# Altium schematic sheet HLK-7621-ALL-KIT-V2.4.SchDoc
size A1
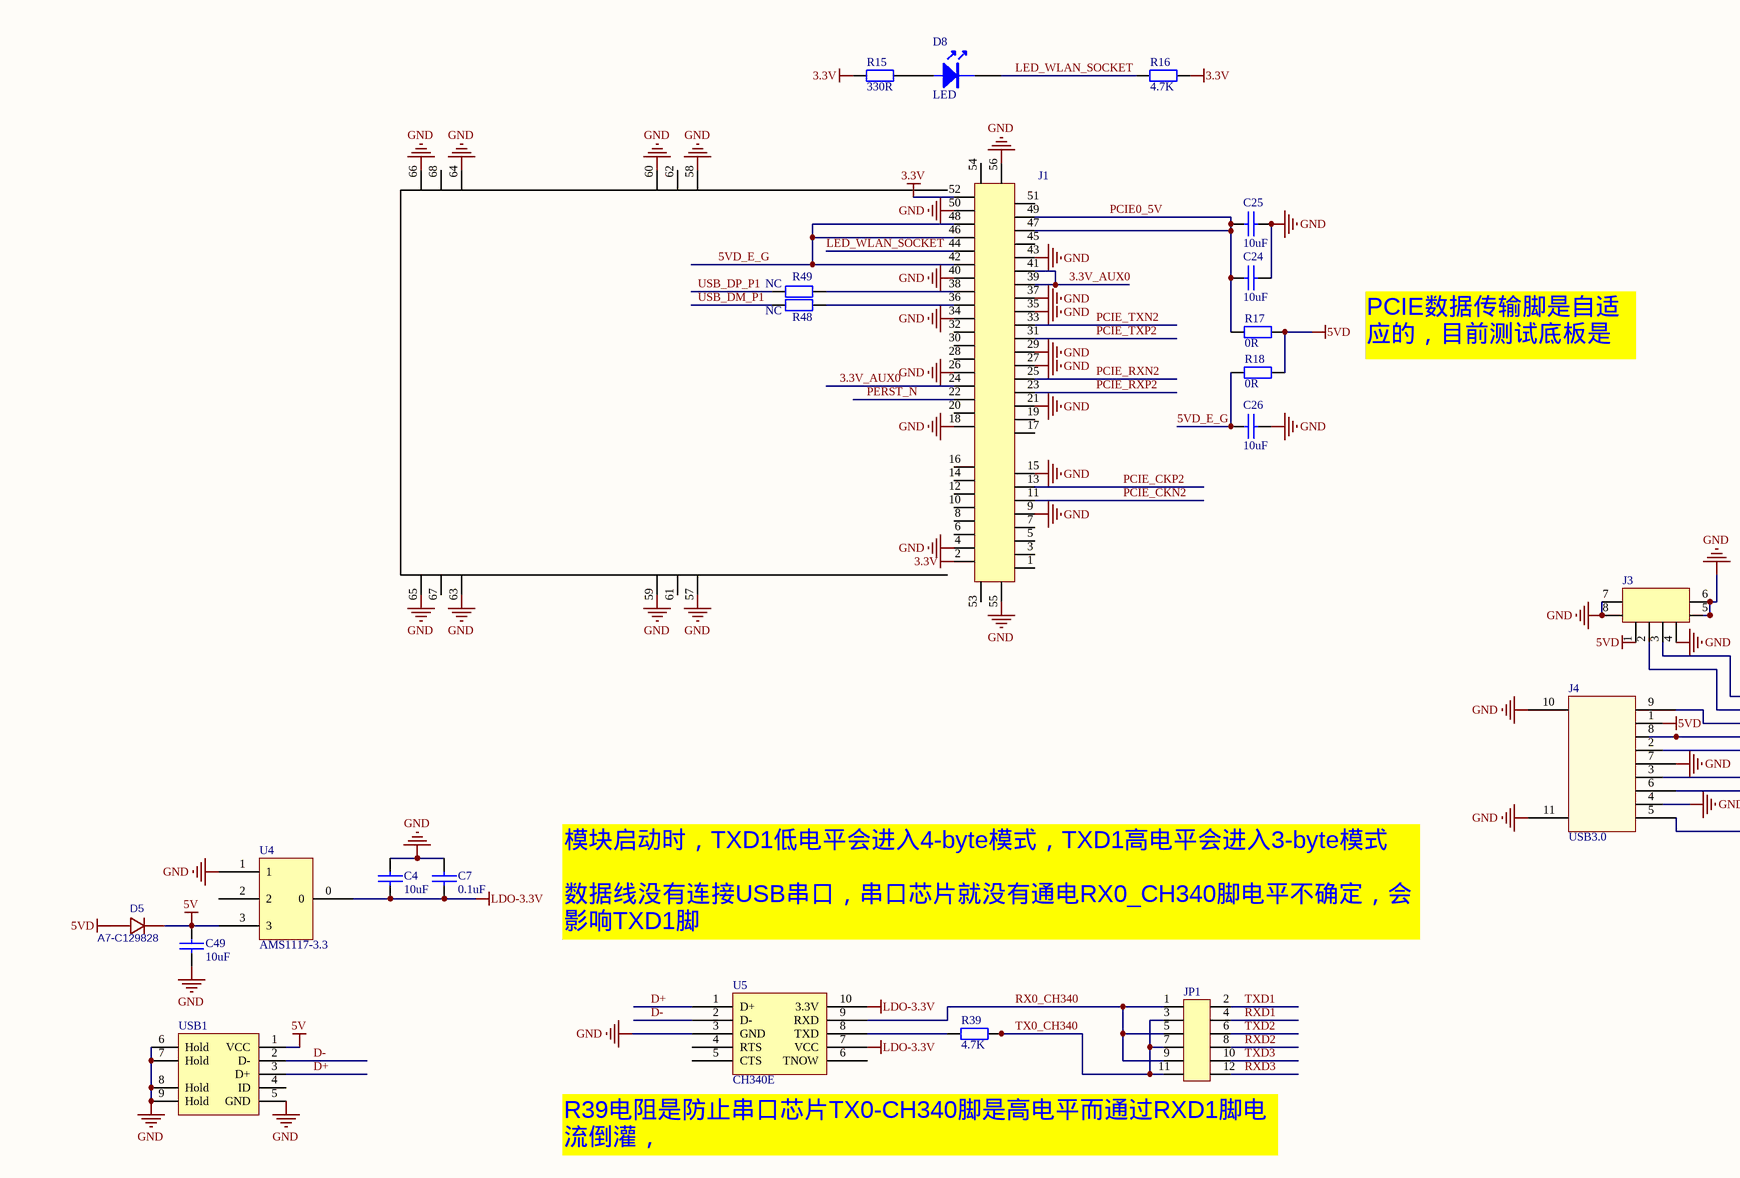
[diagram p0: HLK-7621-ALL-KIT-V2.4.SchDoc, top left]
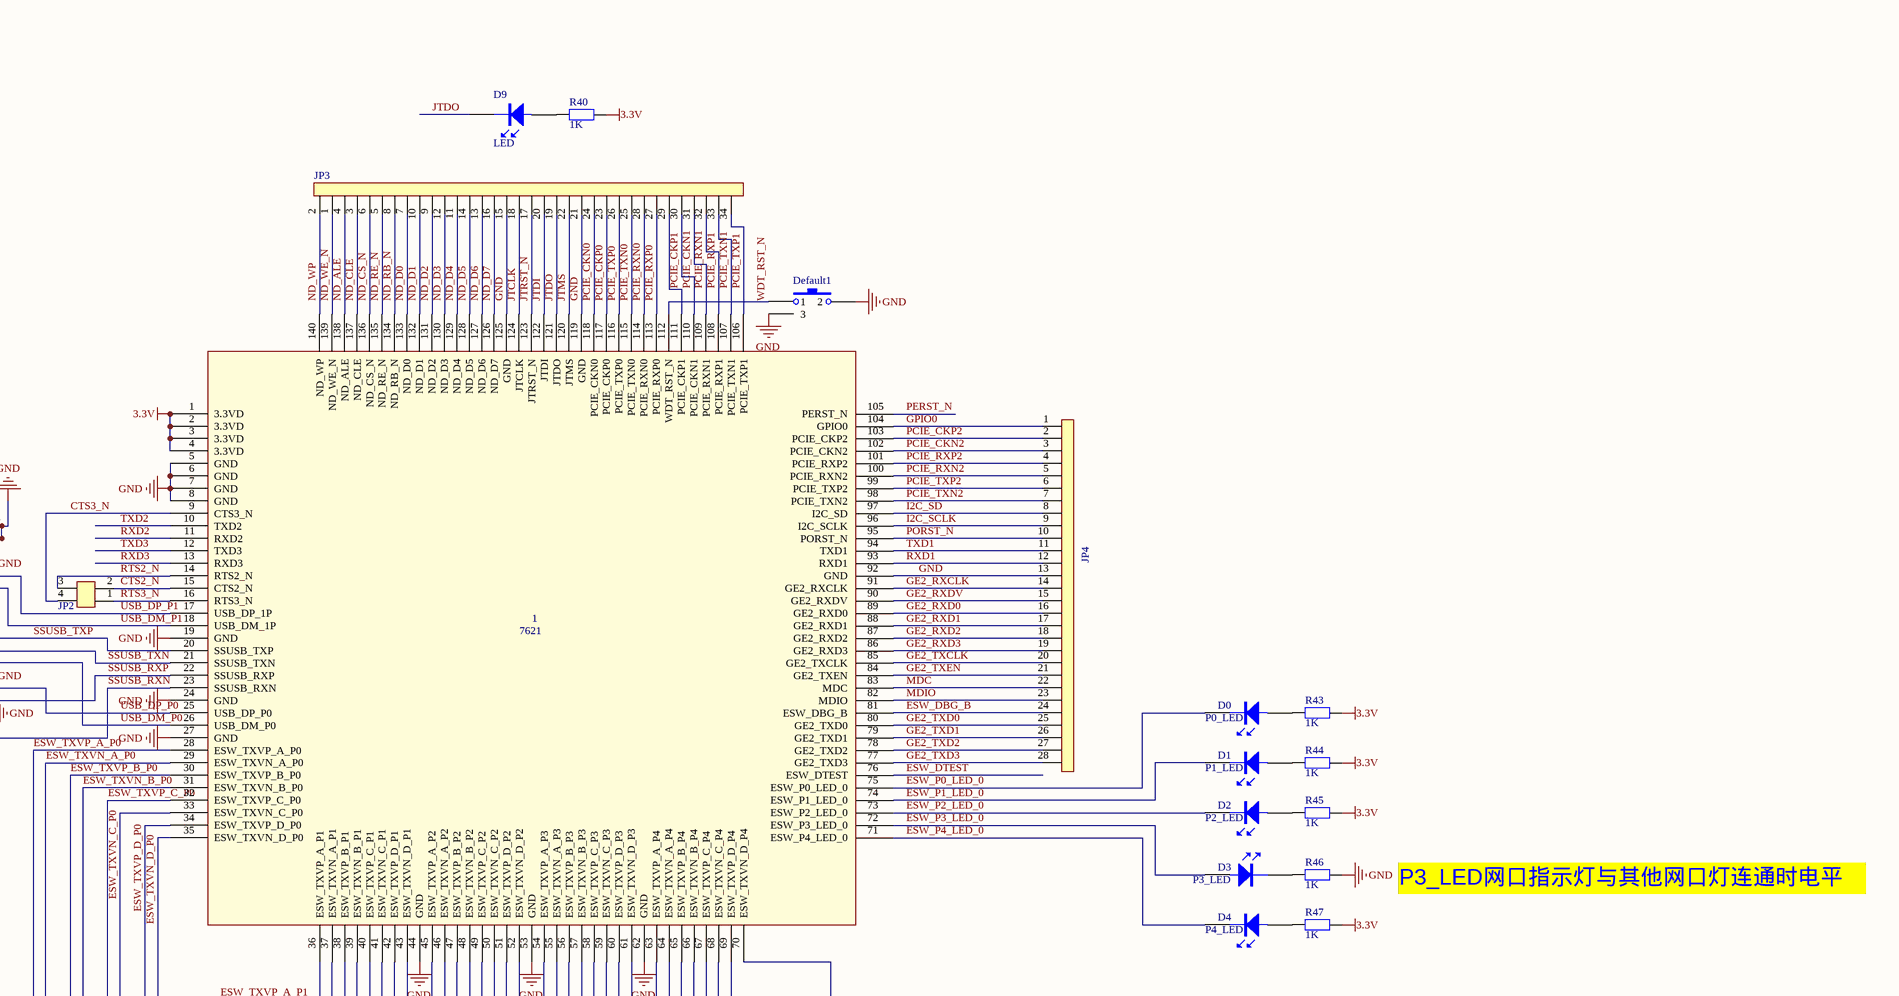
[diagram p1: HLK-7621-ALL-KIT-V2.4.SchDoc, top right]
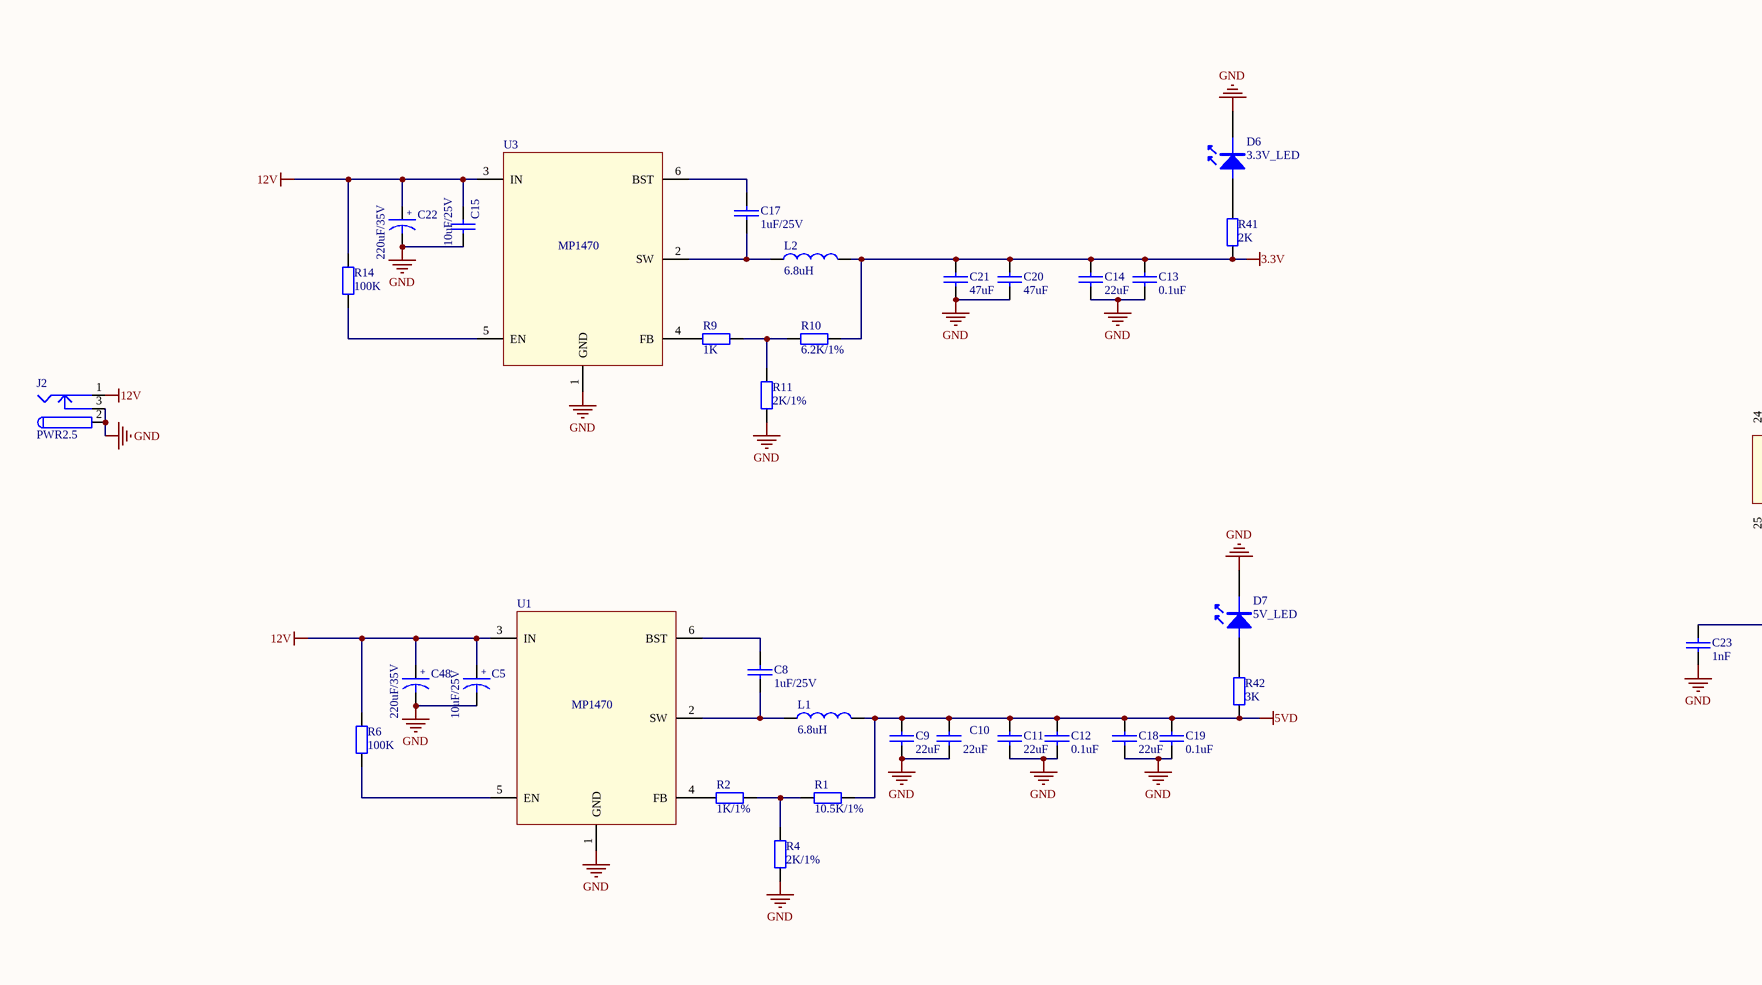
[diagram p2: HLK-7621-ALL-KIT-V2.4.SchDoc, bottom left]
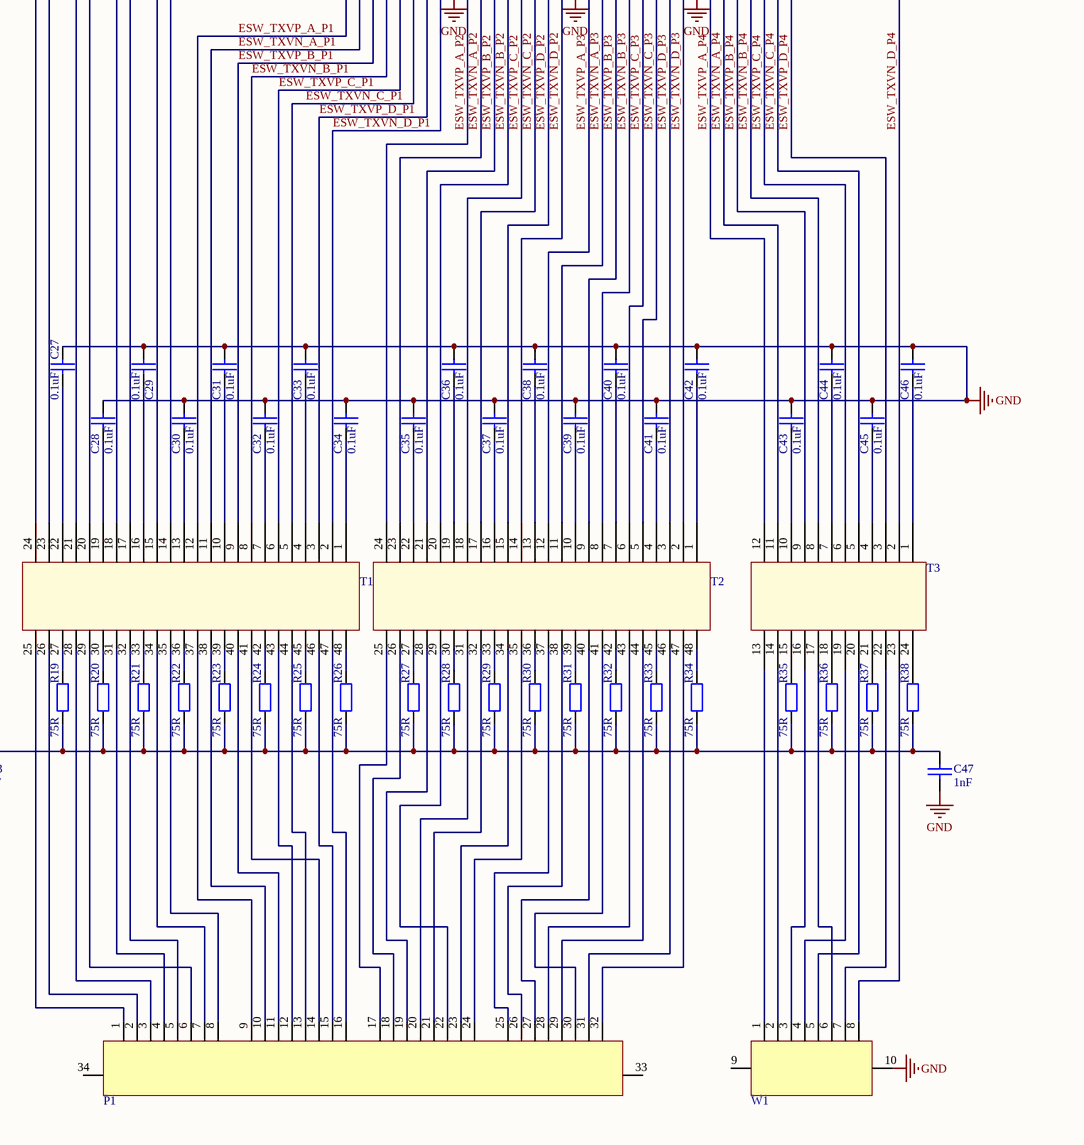
[diagram p3: HLK-7621-ALL-KIT-V2.4.SchDoc, bottom right]

## Parts
1  7621  [HLK-7621]
C4  10uF  [0603]
C5  10uF/25V  [L0805]
C7  0.1uF  [0603]
C8  1uF/25V  [0603]
C9  22uF  [0603]
C10  22uF  [0603]
C11  22uF  [0603]
C12  0.1uF  [0603]
C13  0.1uF  [0603]
C14  22uF  [0603]
C15  10uF/25V  [L0805]
C17  1uF/25V  [0603]
C18  22uF  [0603]
C19  0.1uF  [0603]
C20  47uF  [0603]
C21  47uF  [0603]
C22  220uF/35V  [CAP_SMT_8*10.5]
C23  1nF  [C1206]
C24  10uF  [C1206]
C25  10uF  [C1206]
C26  10uF  [C1206]
C27  0.1uF  [C0402]
C28  0.1uF  [C0402]
C29  0.1uF  [C0402]
C30  0.1uF  [C0402]
C31  0.1uF  [C0402]
C32  0.1uF  [C0402]
C33  0.1uF  [C0402]
C34  0.1uF  [C0402]
C35  0.1uF  [C0402]
C36  0.1uF  [C0402]
C37  0.1uF  [C0402]
C38  0.1uF  [C0402]
C39  0.1uF  [C0402]
C40  0.1uF  [C0402]
C41  0.1uF  [C0402]
C42  0.1uF  [C0402]
C43  0.1uF  [C0402]
C44  0.1uF  [C0402]
C45  0.1uF  [C0402]
C46  0.1uF  [C0402]
C47  1nF  [C1206]
C48  220uF/35V  [CAP_SMT_8*10.5]
C49  10uF  [0603]
D0  P0_LED  [0603LED]
D1  P1_LED  [0603LED]
D2  P2_LED  [0603LED]
D3  P3_LED  [0603LED]
D4  P4_LED  [0603LED]
D5  A7-C129828  [SOD-123F_L2.8-W1.8-LS3.7-RD]
D6  3.3V_LED  [0603LED]
D7  5V_LED  [0603LED]
D8  LED  [0603LED]
D9  LED  [0603LED]
Default1  SW-PB  [K5]  (value not drawn)
J1  (no value)  [CONSG/54/MINICARD/AS0B22-S68-7F/HALF/FUL]
J2  PWR2.5
J3  (no value)
J4  USB3.0
JP1  (no value)  [HDR2X6]
JP2  (no value)  [HDR2X2]
JP3  (no value)  [HDR2X17]
JP4  2  [HDR2X17]  (value not drawn)
L1  6.8uH  [4.7uH SMD,5.8x5.2x4.5mm]
L2  6.8uH  [4.7uH SMD,5.8x5.2x4.5mm]
P1  Component_2  [PHJ8X4_N]  (value not drawn)
R1  10.5K/1%  [0603]
R2  1K/1%  [0603]
R4  2K/1%  [0603]
R6  100K  [0603]
R9  1K  [0603]
R10  6.2K/1%  [0603]
R11  2K/1%  [0603]
R14  100K  [0603]
R15  330R  [0603]
R16  4.7K  [0603]
R17  0R  [L0805]
R18  0R  [R1206]
R19  75R  [R0402]
R20  75R  [R0402]
R21  75R  [R0402]
R22  75R  [R0402]
R23  75R  [R0402]
R24  75R  [R0402]
R25  75R  [R0402]
R26  75R  [R0402]
R27  75R  [R0402]
R28  75R  [R0402]
R29  75R  [R0402]
R30  75R  [R0402]
R31  75R  [R0402]
R32  75R  [R0402]
R33  75R  [R0402]
R34  75R  [R0402]
R35  75R  [R0402]
R36  75R  [R0402]
R37  75R  [R0402]
R38  75R  [R0402]
R39  4.7K  [0603]
R40  1K  [0603]
R41  2K  [0603]
R42  3K  [0603]
R43  1K  [0603]
R44  1K  [0603]
R45  1K  [0603]
R46  1K  [0603]
R47  1K  [0603]
R48  NC  [0603]
R49  NC  [0603]
T1  HN4824CG  [TRANSFORMER/48P/SMD/GS5014LF]  (value not drawn)
T2  HN4824CG  [TRANSFORMER/48P/SMD/GS5014LF]  (value not drawn)
T3  HN2409CG  [TRANSFORMER/24P/SMD/HN2429CG]  (value not drawn)
U1  MP1470  [MP1470]
U3  MP1470  [MP1470]
U4  AMS1117-3.3  [1117]
U5  CH340E  [MSOP-10]
USB1  USB1  (value not drawn)
W1  Component_3  [PCBComponent_1]  (value not drawn)

## Nets
3.3V: 1.1(3.3VD) 1.2(3.3VD) 1.3(3.3VD) 1.4(3.3VD) C13.1 C14.1 C20.1 C21.1 J1.2 J1.52 L2.2 R10.1 R15.2 R16.1 R40.1 R41.1 R43.1 R44.1 R45.1 R47.1
5V: C49.2 D5.1 U4.3 USB1.1(VCC)
5VD: C9.1 C10.1 C11.1 C12.1 C18.1 C19.1 D5.2 J3.1 J4.1 L1.2 R1.1 R17.2 R18.1 R42.1
12V: C5.1 C15.1 C22.1 C48.1 J2.1 R6.2 R14.2 U1.3(IN) U3.3(IN)
GND: 1.5(GND) 1.6(GND) 1.7(GND) 1.8(GND) 1.19(GND) 1.24(GND) 1.27(GND) 1.44(GND) 1.53(GND) 1.62(GND) 1.92(GND) 1.119(GND) 1.125(GND) C4.2 C5.2 C7.2 C9.2 C10.2 C11.2 C12.2 C13.2 C14.2 C15.2 C18.2 C19.2 C20.2 C21.2 C22.2 C23.2 C24.2 C25.2 C26.2 C27.1 C28.1 C29.1 C30.1 C31.1 C32.1 C33.1 C34.1 C35.1 C36.1 C37.1 C38.1 C39.1 C40.1 C41.1 C42.1 C43.1 C44.1 C45.1 C46.1 C47.2 C48.2 C49.1 D6.2 D7.2 Default1.2 Default1.3 J1.4 J1.9 J1.15 J1.18 J1.21 J1.26 J1.27 J1.29 J1.34 J1.35 J1.37 J1.40 J1.43 J1.50 J1.55 J1.56 J1.57 J1.58 J1.59 J1.60 J1.63 J1.64 J1.65 J1.66 J2.2 J2.3 J3.4 J3.5 J3.6 J3.7 J3.8 J4.4 J4.7 J4.10 J4.11 JP3.15 JP3.21 JP4.13 R4.1 R11.1 R46.1 U1.1(GND) U3.1(GND) U4.1 U5.3(GND) USB1.5(GND) USB1.6(Hold) USB1.7(Hold) USB1.8(Hold) USB1.9(Hold) W1.10
LDO-3.3V: C4.1 C7.1 U4.0 U5.7(VCC) U5.10(3.3V)
3.3V_AUX0: J1.24 J1.39 J1.41
5VD_E_G: C26.1 J1.42 J1.46 J1.48 R18.2
CTS2_N: 1.15(CTS2_N) JP2.2
CTS3_N: 1.9(CTS3_N) JP2.4
D+: U5.1(D+) USB1.3(D+)
D-: U5.2(D-) USB1.2(D-)
ESW_DBG_B: 1.81(ESW_DBG_B) JP4.24
ESW_DTEST: 1.76(ESW_DTEST)
ESW_P0_LED_0: 1.75(ESW_P0_LED_0) D0.2
ESW_P1_LED_0: 1.74(ESW_P1_LED_0) D1.2
ESW_P2_LED_0: 1.73(ESW_P2_LED_0) D2.2
ESW_P3_LED_0: 1.72(ESW_P3_LED_0) D3.1
ESW_P4_LED_0: 1.71(ESW_P4_LED_0) D4.2
ESW_TXVN_A_P0: 1.29(ESW_TXVN_A_P0) T1.23
ESW_TXVN_A_P1: 1.37(ESW_TXVN_A_P1) T1.11
ESW_TXVN_A_P2: 1.46(ESW_TXVN_A_P2) T2.23
ESW_TXVN_A_P3: 1.55(ESW_TXVN_A_P3) T2.11
ESW_TXVN_A_P4: 1.64(ESW_TXVN_A_P4) T3.11
ESW_TXVN_B_P0: 1.31(ESW_TXVN_B_P0) T1.20
ESW_TXVN_B_P1: 1.39(ESW_TXVN_B_P1) T1.8
ESW_TXVN_B_P2: 1.48(ESW_TXVN_B_P2) T2.20
ESW_TXVN_B_P3: 1.57(ESW_TXVN_B_P3) T2.8
ESW_TXVN_B_P4: 1.66(ESW_TXVN_B_P4) T3.8
ESW_TXVN_C_P0: 1.33(ESW_TXVN_C_P0) T1.17
ESW_TXVN_C_P1: 1.41(ESW_TXVN_C_P1) T1.5
ESW_TXVN_C_P2: 1.50(ESW_TXVN_C_P2) T2.17
ESW_TXVN_C_P3: 1.59(ESW_TXVN_C_P3) T2.5
ESW_TXVN_C_P4: 1.68(ESW_TXVN_C_P4) T3.5
ESW_TXVN_D_P0: 1.35(ESW_TXVN_D_P0) T1.14
ESW_TXVN_D_P1: 1.43(ESW_TXVN_D_P1) T1.2
ESW_TXVN_D_P2: 1.52(ESW_TXVN_D_P2) T2.14
ESW_TXVN_D_P3: 1.61(ESW_TXVN_D_P3) T2.2
ESW_TXVN_D_P4: 1.70(ESW_TXVN_D_P4) T3.2
ESW_TXVP_A_P0: 1.28(ESW_TXVP_A_P0) T1.24
ESW_TXVP_A_P1: 1.36(ESW_TXVP_A_P1) T1.12
ESW_TXVP_A_P2: 1.45(ESW_TXVP_A_P2) T2.24
ESW_TXVP_A_P3: 1.54(ESW_TXVP_A_P3) T2.12
ESW_TXVP_A_P4: 1.63(ESW_TXVP_A_P4) T3.12
ESW_TXVP_B_P0: 1.30(ESW_TXVP_B_P0) T1.21
ESW_TXVP_B_P1: 1.38(ESW_TXVP_B_P1) T1.9
ESW_TXVP_B_P2: 1.47(ESW_TXVP_B_P2) T2.21
ESW_TXVP_B_P3: 1.56(ESW_TXVP_B_P3) T2.9
ESW_TXVP_B_P4: 1.65(ESW_TXVP_B_P4) T3.9
ESW_TXVP_C_P0: 1.32(ESW_TXVP_C_P0) T1.18
ESW_TXVP_C_P1: 1.40(ESW_TXVP_C_P1) T1.6
ESW_TXVP_C_P2: 1.49(ESW_TXVP_C_P2) T2.18
ESW_TXVP_C_P3: 1.58(ESW_TXVP_C_P3) T2.6
ESW_TXVP_C_P4: 1.67(ESW_TXVP_C_P4) T3.6
ESW_TXVP_D_P0: 1.34(ESW_TXVP_D_P0) T1.15
ESW_TXVP_D_P1: 1.42(ESW_TXVP_D_P1) T1.3
ESW_TXVP_D_P2: 1.51(ESW_TXVP_D_P2) T2.15
ESW_TXVP_D_P3: 1.60(ESW_TXVP_D_P3) T2.3
ESW_TXVP_D_P4: 1.69(ESW_TXVP_D_P4) T3.3
GE2_RXCLK: 1.91(GE2_RXCLK) JP4.14
GE2_RXD0: 1.89(GE2_RXD0) JP4.16
GE2_RXD1: 1.88(GE2_RXD1) JP4.17
GE2_RXD2: 1.87(GE2_RXD2) JP4.18
GE2_RXD3: 1.86(GE2_RXD3) JP4.19
GE2_RXDV: 1.90(GE2_RXDV) JP4.15
GE2_TXCLK: 1.85(GE2_TXCLK) JP4.20
GE2_TXD0: 1.80(GE2_TXD0) JP4.25
GE2_TXD1: 1.79(GE2_TXD1) JP4.26
GE2_TXD2: 1.78(GE2_TXD2) JP4.27
GE2_TXD3: 1.77(GE2_TXD3) JP4.28
GE2_TXEN: 1.84(GE2_TXEN) JP4.21
GPIO0: 1.104(GPIO0) JP4.1
I2C_SCLK: 1.96(I2C_SCLK) JP4.9
I2C_SD: 1.97(I2C_SD) JP4.8
JTCLK: 1.124(JTCLK) JP3.18
JTDI: 1.122(JTDI) JP3.20
JTDO: 1.121(JTDO) D9.2 JP3.19
JTMS: 1.120(JTMS) JP3.22
JTRST_N: 1.123(JTRST_N) JP3.17
LED_WLAN_SOCKET: D8.1 J1.44 R16.2
MDC: 1.83(MDC) JP4.22
MDIO: 1.82(MDIO) JP4.23
ND_ALE: 1.138(ND_ALE) JP3.4
ND_CLE: 1.137(ND_CLE) JP3.3
ND_CS_N: 1.136(ND_CS_N) JP3.6
ND_D0: 1.133(ND_D0) JP3.7
ND_D1: 1.132(ND_D1) JP3.10
ND_D2: 1.131(ND_D2) JP3.9
ND_D3: 1.130(ND_D3) JP3.12
ND_D4: 1.129(ND_D4) JP3.11
ND_D5: 1.128(ND_D5) JP3.14
ND_D6: 1.127(ND_D6) JP3.13
ND_D7: 1.126(ND_D7) JP3.16
ND_RB_N: 1.134(ND_RB_N) JP3.8
ND_RE_N: 1.135(ND_RE_N) JP3.5
ND_WE_N: 1.139(ND_WE_N) JP3.1
ND_WP: 1.140(ND_WP) JP3.2
PCIE0_5V: C24.1 C25.1 J1.47 J1.49 R17.1
PCIE_CKN0: 1.118(PCIE_CKN0) JP3.24
PCIE_CKN1: 1.110(PCIE_CKN1) JP3.30
PCIE_CKN2: 1.102(PCIE_CKN2) J1.11 JP4.3
PCIE_CKP0: 1.117(PCIE_CKP0) JP3.23
PCIE_CKP1: 1.111(PCIE_CKP1) JP3.29
PCIE_CKP2: 1.103(PCIE_CKP2) J1.13 JP4.2
PCIE_RXN0: 1.114(PCIE_RXN0) JP3.28
PCIE_RXN1: 1.109(PCIE_RXN1) JP3.31
PCIE_RXN2: 1.100(PCIE_RXN2) J1.25 JP4.5
PCIE_RXP0: 1.113(PCIE_RXP0) JP3.27
PCIE_RXP1: 1.108(PCIE_RXP1) JP3.32
PCIE_RXP2: 1.101(PCIE_RXP2) J1.23 JP4.4
PCIE_TXN0: 1.115(PCIE_TXN0) JP3.25
PCIE_TXN1: 1.107(PCIE_TXN1) JP3.33
PCIE_TXN2: 1.98(PCIE_TXN2) J1.33 JP4.7
PCIE_TXP0: 1.116(PCIE_TXP0) JP3.26
PCIE_TXP1: 1.106(PCIE_TXP1) JP3.34
PCIE_TXP2: 1.99(PCIE_TXP2) J1.31 JP4.6
PERST_N: 1.105(PERST_N) J1.22
PORST_N: 1.95(PORST_N) JP4.10
RTS2_N: 1.14(RTS2_N) JP2.3
RTS3_N: 1.16(RTS3_N) JP2.1
RX0_CH340: JP1.1 JP1.5 JP1.9 U5.9(RXD)
RXD1: 1.93(RXD1) JP1.4 JP4.12
RXD2: 1.11(RXD2) JP1.8
RXD3: 1.13(RXD3) JP1.12
SSUSB_RXN: 1.23(SSUSB_RXN) J4.5
SSUSB_RXP: 1.22(SSUSB_RXP) J4.6
SSUSB_TXN: 1.21(SSUSB_TXN) J4.8
SSUSB_TXP: 1.20(SSUSB_TXP) J4.9
TX0_CH340: JP1.3 JP1.7 JP1.11 R39.2
TXD1: 1.94(TXD1) JP1.2 JP4.11
TXD2: 1.10(TXD2) JP1.6
TXD3: 1.12(TXD3) JP1.10
USB_DM_P0: 1.26(USB_DM_P0) J4.2
USB_DM_P1: 1.18(USB_DM_1P) J3.2 R48.2
USB_DP_P0: 1.25(USB_DP_P0) J4.3
USB_DP_P1: 1.17(USB_DP_1P) J3.3 R49.2
WDT_RST_N: 1.112(WDT_RST_N) Default1.1
NetC8_1: C8.1 L1.1 U1.2(SW)
NetC8_2: C8.2 U1.6(BST)
NetC17_1: C17.1 L2.1 U3.2(SW)
NetC17_2: C17.2 U3.6(BST)
NetC23_1: C23.1 C47.1 R19.1 R20.1 R21.1 R22.1 R23.1 R24.1 R25.1 R26.1 R27.1 R28.1 R29.1 R30.1 R31.1 R32.1 R33.1 R34.1 R35.1 R36.1 R37.1 R38.1
NetC27_2: C27.2 T1.22
NetC28_2: C28.2 T1.19
NetC29_2: C29.2 T1.16
NetC30_2: C30.2 T1.13
NetC31_2: C31.2 T1.10
NetC32_2: C32.2 T1.7
NetC33_2: C33.2 T1.4
NetC34_2: C34.2 T1.1
NetC35_2: C35.2 T2.22
NetC36_2: C36.2 T2.19
NetC37_2: C37.2 T2.16
NetC38_2: C38.2 T2.13
NetC39_2: C39.2 T2.10
NetC40_2: C40.2 T2.7
NetC41_2: C41.2 T2.4
NetC42_2: C42.2 T2.1
NetC43_2: C43.2 T3.10
NetC44_2: C44.2 T3.7
NetC45_2: C45.2 T3.4
NetC46_2: C46.2 T3.1
NetD0_1: D0.1 R43.2
NetD1_1: D1.1 R44.2
NetD2_1: D2.1 R45.2
NetD3_2: D3.2 R46.2
NetD4_1: D4.1 R47.2
NetD6_1: D6.1 R41.2
NetD7_1: D7.1 R42.2
NetD8_2: D8.2 R15.1
NetD9_1: D9.1 R40.2
NetJ1_36: J1.36 R48.1
NetJ1_38: J1.38 R49.1
NetP1_1: P1.1 T1.25
NetP1_2: P1.2 T1.26
NetP1_3: P1.3 T1.28
NetP1_4: P1.4 T1.31
NetP1_5: P1.5 T1.32
NetP1_6: P1.6 T1.29
NetP1_7: P1.7 T1.34
NetP1_8: P1.8 T1.35
NetP1_9: P1.9 T1.37
NetP1_10: P1.10 T1.38
NetP1_11: P1.11 T1.40
NetP1_12: P1.12 T1.43
NetP1_13: P1.13 T1.44
NetP1_14: P1.14 T1.41
NetP1_15: P1.15 T1.46
NetP1_16: P1.16 T1.47
NetP1_17: P1.17 T2.25
NetP1_18: P1.18 T2.26
NetP1_19: P1.19 T2.28
NetP1_20: P1.20 T2.31
NetP1_21: P1.21 T2.32
NetP1_22: P1.22 T2.29
NetP1_23: P1.23 T2.34
NetP1_24: P1.24 T2.35
NetP1_25: P1.25 T2.37
NetP1_26: P1.26 T2.38
NetP1_27: P1.27 T2.40
NetP1_28: P1.28 T2.43
NetP1_29: P1.29 T2.44
NetP1_30: P1.30 T2.41
NetP1_31: P1.31 T2.46
NetP1_32: P1.32 T2.47
NetR1_2: R1.2 R2.1 R4.2
NetR2_2: R2.2 U1.4(FB)
NetR6_1: R6.1 U1.5(EN)
NetR9_1: R9.1 R10.2 R11.2
NetR9_2: R9.2 U3.4(FB)
NetR14_1: R14.1 U3.5(EN)
NetR19_2: R19.2 T1.27
NetR20_2: R20.2 T1.30
NetR21_2: R21.2 T1.33
NetR22_2: R22.2 T1.36
NetR23_2: R23.2 T1.39
NetR24_2: R24.2 T1.42
NetR25_2: R25.2 T1.45
NetR26_2: R26.2 T1.48
NetR27_2: R27.2 T2.27
NetR28_2: R28.2 T2.30
NetR29_2: R29.2 T2.33
NetR30_2: R30.2 T2.36
NetR31_2: R31.2 T2.39
NetR32_2: R32.2 T2.42
NetR33_2: R33.2 T2.45
NetR34_2: R34.2 T2.48
NetR35_2: R35.2 T3.15
NetR36_2: R36.2 T3.18
NetR37_2: R37.2 T3.21
NetR38_2: R38.2 T3.24
NetR39_1: R39.1 U5.8(TXD)
NetT3_13: T3.13 W1.1
NetT3_14: T3.14 W1.2
NetT3_16: T3.16 W1.3
NetT3_17: T3.17 W1.6
NetT3_19: T3.19 W1.4
NetT3_20: T3.20 W1.5
NetT3_22: T3.22 W1.7
NetT3_23: T3.23 W1.8

Not connected (* = marked no-connect by the designer): J1 1(0) 3 5 6 7 8 10 12 14 16 17 19 20 28 30 32 45 51 53 54 61 62 67 68; P1 33 34; U4 2; U5 4(RTS) 5(CTS) 6(TNOW); USB1 4(ID); W1 9

## Notes on the sheet
- PCIE数据传输脚是自适应的，目前测试底板是交叉连接的。
- 模块启动时，TXD1低电平会进入4-byte模式，TXD1高电平会进入3-byte模式
  数据线没有连接USB串口，串口芯片就没有通电RX0_CH340脚电平不确定，会影响TXD1脚
  所以未使用串口打印请将TXD1的跳线帽拔掉，不然会影响启动
- P3_LED网口指示灯与其他网口灯连通时电平是相反的
- R39电阻是防止串口芯片TX0-CH340脚是高电平而通过RXD1脚电流倒灌，
  导致模块复位重启不了
- (in symbol CAPACITOR POL) +

## Library data of the parts
C4 C7-C15 C17-C21 C23-C47 C49 = CAP: Capacitor
C5 C22 C48 = CAPACITOR POL: Capacitor
D0-D4 D6 D7 = LED
D5 = A7-C129828: BOM_Manufacturer: DIYI Elec Tech; Contributor: LCSC; BOM_Supplier: LCSC; BOM_Supplier Part: C129828; BOM_Manufacturer Part: -; BOM_JLCPCB Part Class: Extended Part; spicePre: D; spiceSymbolName: A7-C129828
Default1 = SW-PB: Switch; Published: 24-Mar-1999; LatestRevisionDate: 17-Jul-2002; LatestRevisionNote: Re-released for DXP Platform.; PackageReference: SPST-2; Publisher: Altium Limited
J1 JP1 U4 = Component_1
J2 = PWR2.5: Low Voltage Power Supply Connector; Published: 17-Dec-2003; DatasheetDocument: 09-May-2002; Publisher: Altium Limited; ComponentLink1Description: Manufacturer Link; ComponentLink1URL: http://domino.kycon.com/internet/Products.html
J3 JP2 JP3 = 2
J4 = USB3.0/9P/DIP/MAINSUPER
L1 L2 = INDUCTOR1
R1 R2 R4 R6 R9-R11 R14-R47 R49 = Res2: Resistor; Published: 8-Jun-2000; LatestRevisionDate: 17-Jul-2002; LatestRevisionNote: Re-released for DXP Platform.; PackageReference: AXIAL-0.4; Publisher: Altium Limited
  R1: Value: 10.5K/1%
  R2: Value: 1K/1%
  R4 R11: Value: 2K/1%
  R6 R14: Value: 100K
  R9 R40 R43-R47: Value: 1K
  R10: Value: 6.2K/1%
  R15: Value: 330R
  R16 R39: Value: 4.7K
  R17 R18: Value: 0R
  R41: Value: 2K
  R42: Value: 3K
  R49: Value: NC
R48 = Res2: Resistor; Value: 2K; Published: 8-Jun-2000; LatestRevisionDate: 17-Jul-2002; LatestRevisionNote: Re-released for DXP Platform.; PackageReference: AXIAL-0.4; Publisher: Altium Limited
T1-T3 = TRANSFORMER/24P/SMD/HN2429CG
USB1 = USB-B